# EAGLE design Smart ezNODE 503 M3 (EAGLE 7.7.0)
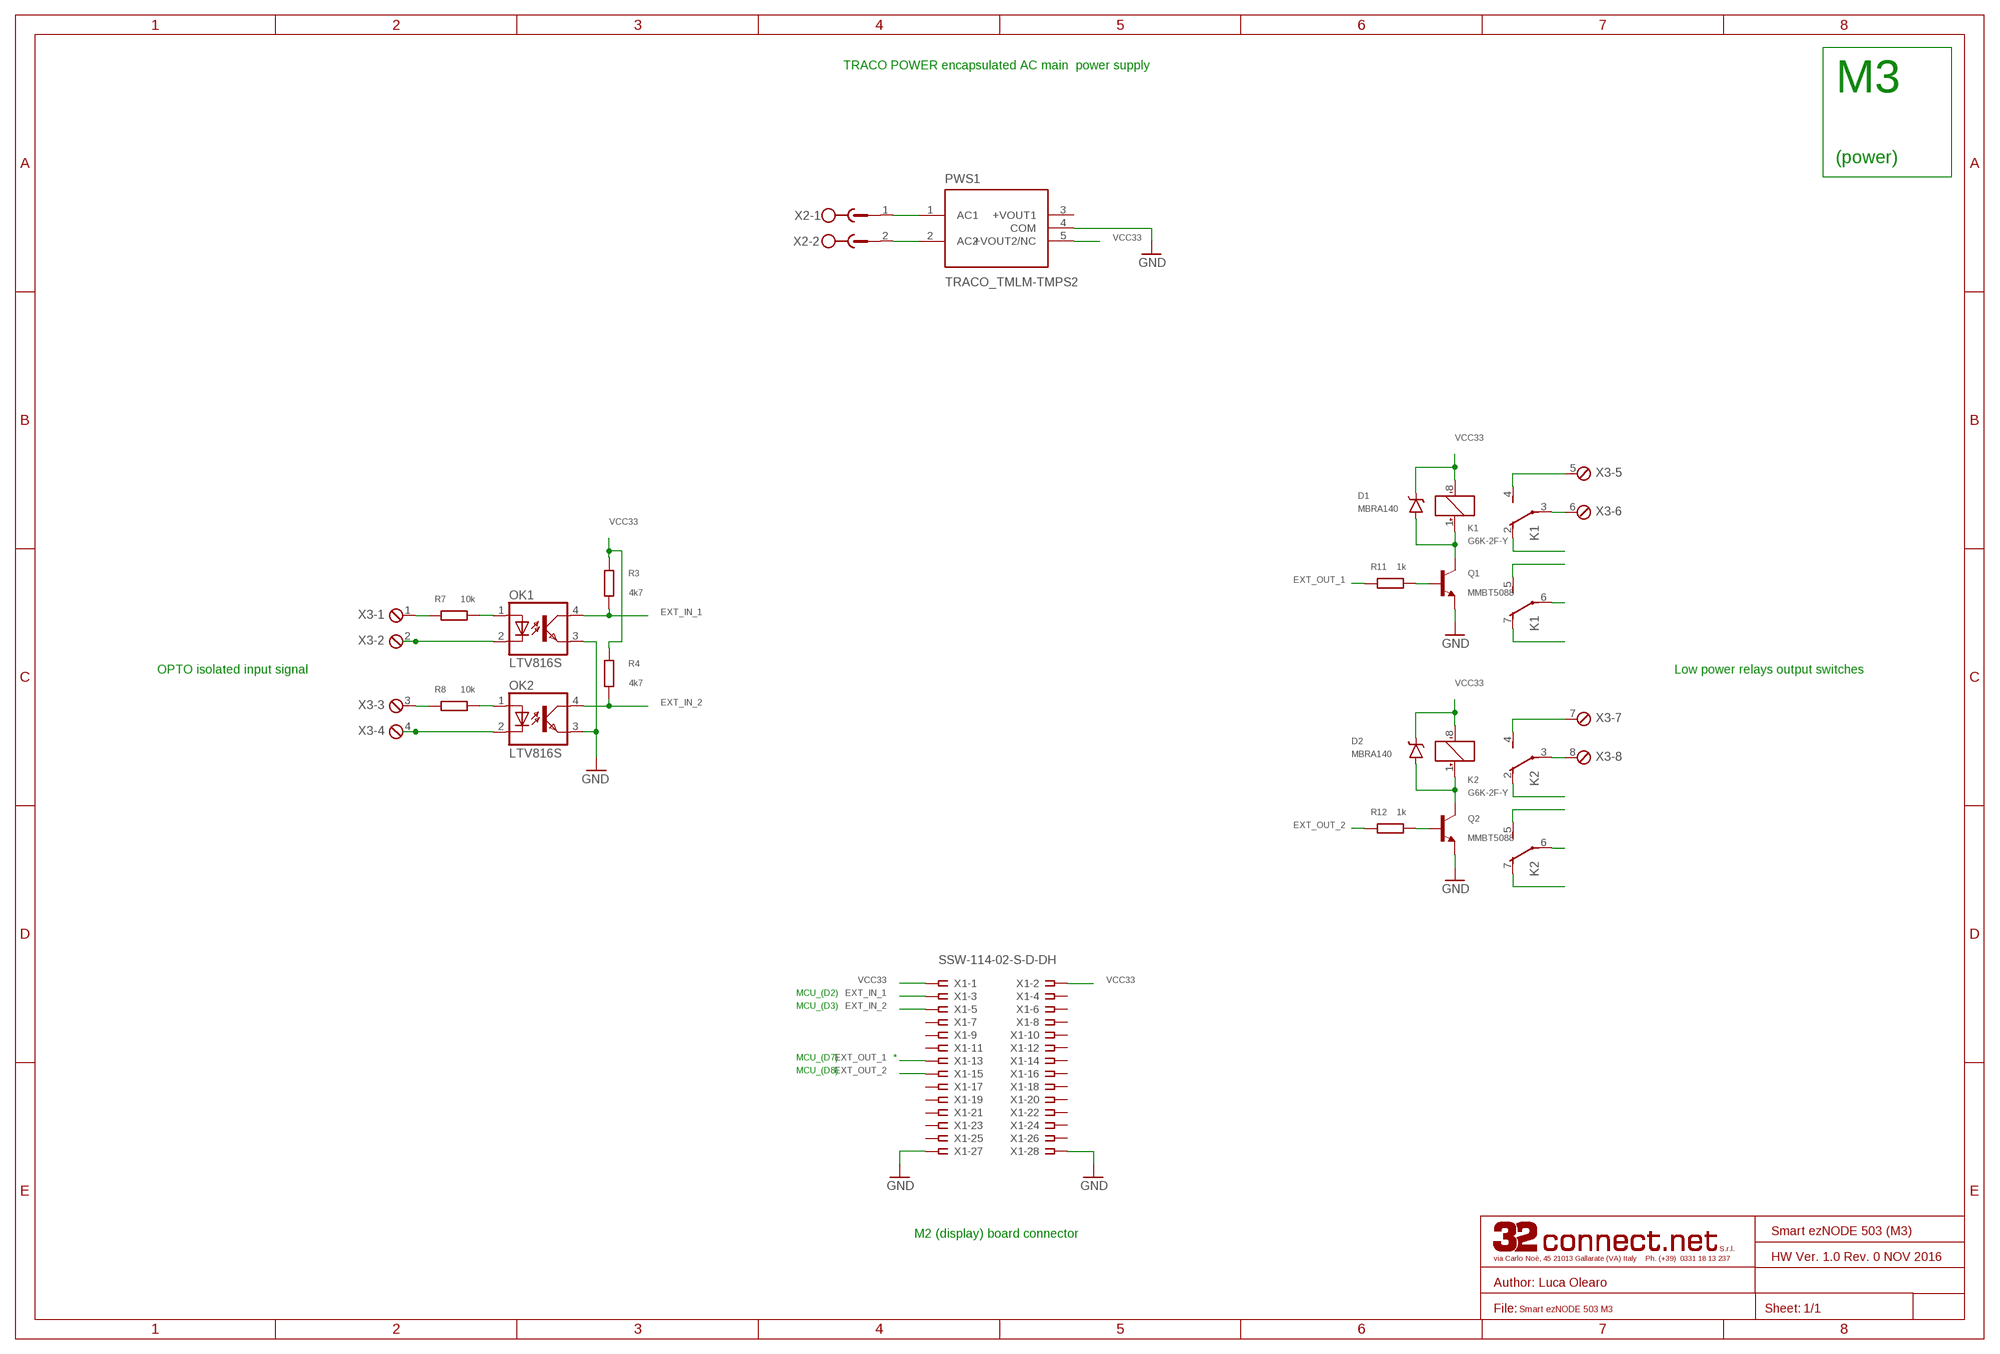
[diagram p0: schematic, sheet 1]

## Parts
D1  MBRA140  [SMA-DIODE]
D2  MBRA140  [SMA-DIODE]
K1  G6K-2F-Y  [G6K-2F-Y]
K2  G6K-2F-Y  [G6K-2F-Y]
OK1  LTV816S  [SMD4]
OK2  LTV816S  [SMD4]
PWS1  TRACO_TMLM-TMPS2  [TRACO_TMPS03XXX]
Q1  MMBT5088  TRANSISTOR_NPNMMBT5088  [SOT23-3]
Q2  MMBT5088  TRANSISTOR_NPNMMBT5088  [SOT23-3]
R3  4k7  R-EU_R0402  [R0402]
R4  4k7  R-EU_R0402  [R0402]
R7  10k  R-EU_R0402  [R0402]
R8  10k  R-EU_R0402  [R0402]
R11  1k  R-EU_R0402  [R0402]
R12  1k  R-EU_R0402  [R0402]
X1  SSW-114-02-S-D-DH  [FTE-114-XX-G-DH]
X2  MSTBV2  [MSTBV2]
X3  MPT8  [8POL254]

## Nets
EXT_IN_1: OK1.4(COL) R3.1 X1.3
EXT_IN_2: OK2.4(COL) R4.1 X1.5
EXT_OUT_1: R11.1 X1.13
EXT_OUT_2: R12.1 X1.15
GND [VCC1]: OK1.3(EMIT) OK2.3(EMIT) PWS1.4(COM) Q1.2(E) Q2.2(E) X1.27 X1.28
N$1: PWS1.1(AC1) X2.1
N$2: PWS1.2(AC2) X2.2
N$3: R7.1 X3.1
N$4: R8.1 X3.3
N$8 [SWITCH]: K1.4(2:S) X3.5
N$12: OK1.2(C) X3.2
N$14: OK1.1(A) R7.2
N$15: OK2.1(A) R8.2
N$16: OK2.2(C) X3.4
N$18 [SWITCH]: K1.3(2:P) X3.6
N$19: D1.A K1.1(1:+) Q1.3(C)
N$20 [SWITCH]: K1.2(2:O)
N$21: D2.A K2.1(1:+) Q2.3(C)
N$22: K1.5(3:S)
N$23: Q1.1(B) R11.2
N$24: Q2.1(B) R12.2
N$25: K1.6(3:P)
N$26: K1.7(3:O)
N$27 [SWITCH]: K2.4(2:S) X3.7
N$28 [SWITCH]: K2.3(2:P) X3.8
N$29 [SWITCH]: K2.2(2:O)
N$30: K2.5(3:S)
N$31: K2.6(3:P)
N$32: K2.7(3:O)
VCC33 [VCC1]: D1.C D2.C K1.8(1:-) K2.8(1:-) PWS1.5(+VOUT2/NC) R3.2 R4.2 X1.1 X1.2
Unconnected: PWS1.3(+VOUT1) X1.4 X1.6 X1.7 X1.8 X1.9 X1.10 X1.11 X1.12 X1.14 X1.16 X1.17 X1.18 X1.19 X1.20 X1.21 X1.22 X1.23 X1.24 X1.25 X1.26

## Notes on the sheet
- TRACO POWER encapsulated AC main  power supply
- M3
- (power)
- OPTO isolated input signal | Low power relays output switches
- MCU_(D2)
- MCU_(D3)
- MCU_(D7) | *
- MCU_(D8)
- M2 (display) board connector
- Smart ezNODE 503 (M3)
- HW Ver. 1.0 Rev. 0 NOV 2016

## Library data of the parts
D1 D2 = SparkFun-DiscreteSemi:MBRA140: 40V, 1A Schottky rectifier SMA/DO-214AC package DIO-08053; PROD_ID: DIO-08053
K1 K2 = relay:G6K: Low Signal Relay oeiwcsnts1.omron.com/.. D20G6K0100.pdf; MF: OMRON COMPONENTS USA; MPN: G6K-2F-Y DC3; OC_FARNELL: 1690316; OC_NEWARK: 89C6451
OK1 OK2 = optocoupler:LTV816: OPTO COUPLER Source: LITEON, LTV816.pdf; OC_FARNELL: unknown; OC_NEWARK: unknown
PWS1 = Multiconnect_base:TRACO_TMLM-TMPS
Q1 Q2 = SparkFun-DiscreteSemi:TRANSISTOR_NPN: Generic NPN BJT MMBT2222A - TRANS-08049 (SOT-23, 1A 40V) MPSA42 - TRANS-09116 (SOT-23, 500mA 300V) MMBT5088LT1G - TRANS-11160 (SOT-23, 50 mA 30V) BC547 - COM-08928 <http://www.sparkfun.com/products/8928> (TO-92 45V 100mA) (1.Collector 2.Base 3.Emitter) 2N3904 - COM-00521 <http://www.sparkfun.com/products/521> (TO-92 40V 200mA) (1.Emitter 2.Base 3.Collector) P2N2222A - COM-12852 <http://www.sparkfun.com/products/12852> (TO-92 40V 600mA) (1.Collector 2.Base 3.Emitter); PROD_ID: TRANS-11160
R3 R4 R7 R8 R11 R12 = rcl:R-EU_: RESISTOR, European symbol
X1 = Multiconnect_base:SSW-114-02-S-D: THROUGH-HOLE .025" SQ POST SOCKET Source: Samtec SSW.pdf
X2 = con-phoenix-500:MSTBV2: PHOENIX; OC_FARNELL: unknown; OC_NEWARK: unknown
X3 = Multiconnect_base:MPT8: PHOENIX CONNECTOR; OC_FARNELL: unknown; OC_NEWARK: unknown

## Net classes
0 default: width 0.203 mm, clearance 0.152 mm
1 VCC1: width 0.508 mm, clearance 0.305 mm
2 AC: width 1.016 mm, clearance 2.54 mm
3 SWITCH: width 0.61 mm, clearance 0.406 mm

## Board
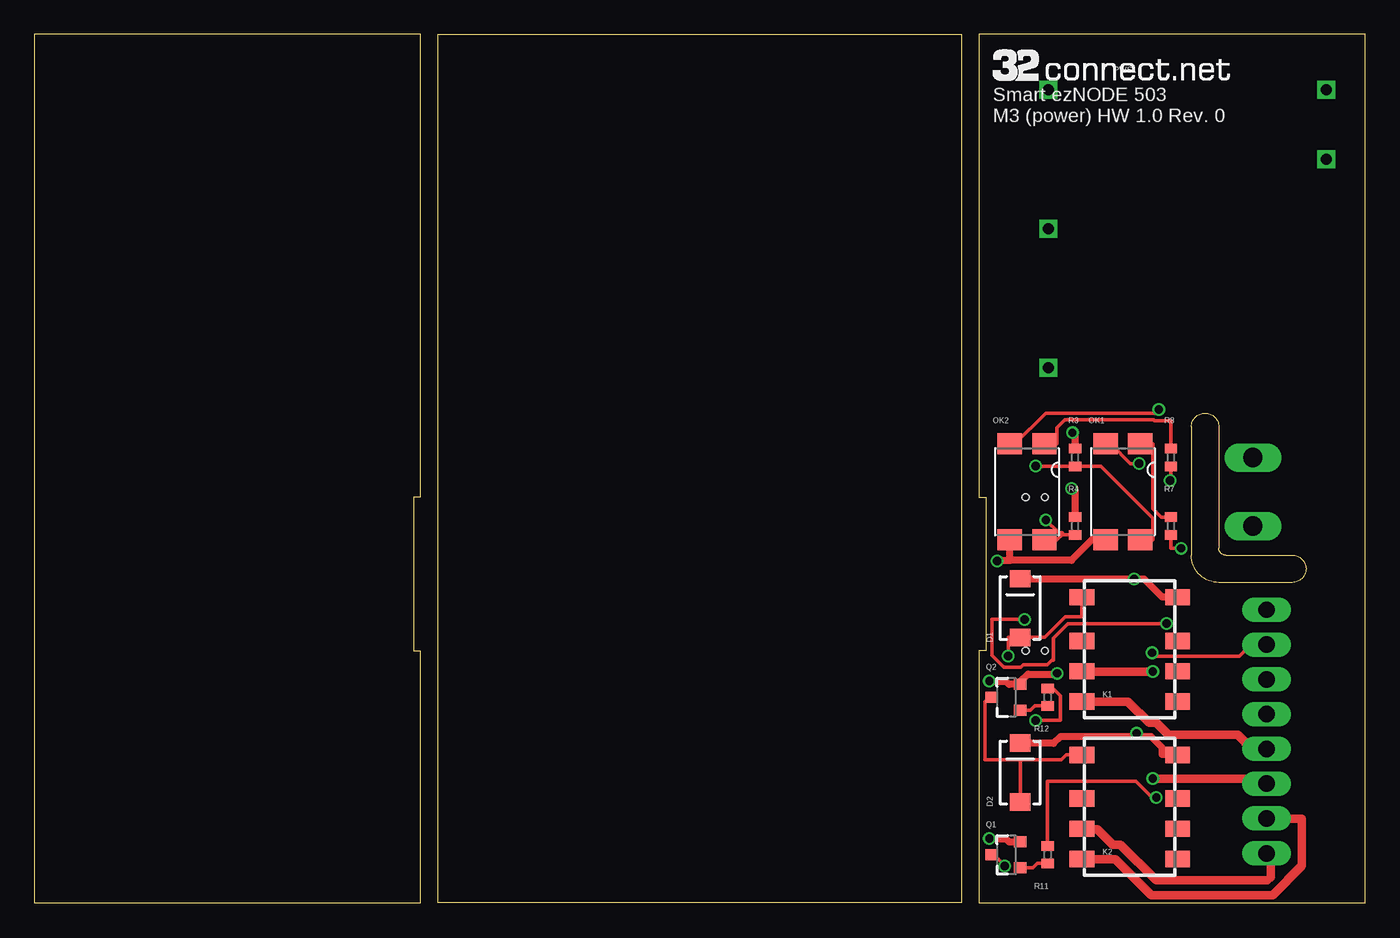
[diagram p1: board, top side]
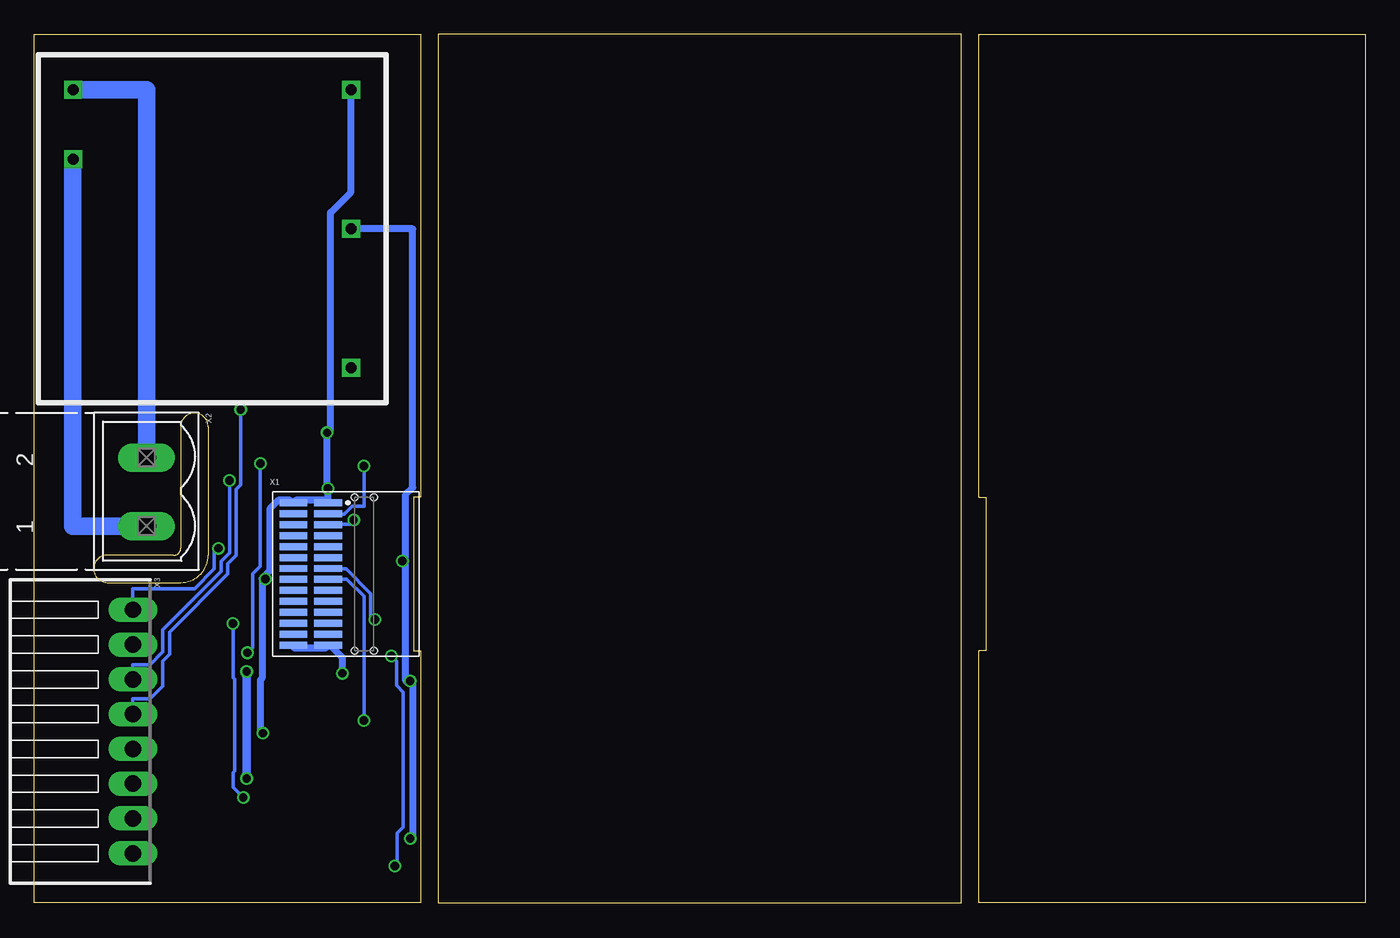
[diagram p2: board, bottom side, seen from below]

Size 97.2 x 63.4 mm. Coordinates in mm from the lower left corner, seen from the top.
Outline: 28.2,0 28.2,18.4 27.7,18.4 27.7,29.6 28.2,29.6 28.2,63.4 0,63.4 0,0 28.2,0
Outline: 67.7,0 29.5,0 29.5,63.4 67.7,63.4 67.7,0
Outline: 97.2,0 97.2,63.4 69,63.4 69,29.6 69.5,29.6 69.5,18.4 69,18.4 69,0 97.2,0
Outline: 84.5,34.75 arc-180 86.5,34.75 86.5,25.88 arc90 87,25.38 91.88,25.38 arc-180 91.88,23.38 86.5,23.38 arc-90 84.5,25.38 84.5,34.75
Copper layers (1*16): Top 0.035mm / dielectric 1.5mm / Bottom 0.035mm
Design rules "default *": minimum track width 10mil, minimum drill 24mil, track to track 8mil, track to pad 8mil, pad to pad 8mil, via to via 8mil, smd to smd 8mil, copper to edge 10mil, drill to drill 8mil, minimum pad ring 10mil, minimum via ring 6mil, stop-mask expansion 4mil, vias tented up to drill 0mil, thermal gap 10mil
Holes 0.5 mm at 72.4,29.6 73.8,29.6 72.4,18.4 73.8,18.4
tKeepout: area 0,62.2 to 13.2,63.4; area 0,0 to 13.2,1.2; area 29.5,0 to 67.7,1.2; area 29.5,62.2 to 67.7,63.4; area 84,62.2 to 97.2,63.4; area 84,0 to 97.2,1.2
bKeepout: area 0,62.2 to 13.2,63.4; area 0,0 to 13.2,1.2; area 29.5,0 to 67.7,1.2; area 29.5,62.2 to 67.7,63.4; area 84,62.2 to 97.2,63.4; area 84,0 to 97.2,1.2

### Footprints (pad centres in the part's own frame; a part is rotated, then mirrored left to right if it is on the bottom)
SMA-DIODE = smd 1.27 x 1.47: A -2.15,0; C 2.15,0
G6K-2F-Y = smd 1.2 x 1.8: 1 -3.8,-3.5; 2 -0.6,-3.5; 3 1.6,-3.5; 4 3.8,-3.5; 5 3.8,3.5; 6 1.6,3.5; 7 -0.6,3.5; 8 -3.8,3.5
SMD4 = smd 1.78 x 1.55: 1 -1.27,-3.5; 2 1.27,-3.5; 3 1.27,3.5; 4 -1.27,3.5
TRACO_TMPS03XXX = drill 0.8 square: 1 17.78,22.86; 2 22.86,22.86; 3 2.54,2.56; 4 12.7,2.56; 5 22.86,2.56
SOT23-3 = smd 0.8 x 0.9: 1 -0.95,-1; 2 0.95,-1; 3 0,1.1
R0402 = smd 0.7 x 0.9: 1 -0.65,0; 2 0.65,0
FTE-114-XX-G-DH = smd 0.508 x 2.032: 1 -5.2,1.27; 2 -5.2,-1.27; 3 -4.4,1.27; 4 -4.4,-1.27; 5 -3.6,1.27; 6 -3.6,-1.27; 7 -2.8,1.27; 8 -2.8,-1.27; 9 -2,1.27; 10 -2,-1.27; 11 -1.2,1.27; 12 -1.2,-1.27; 13 -0.4,1.27; 14 -0.4,-1.27; 15 0.4,1.27; 16 0.4,-1.27; 17 1.2,1.27; 18 1.2,-1.27; 19 2,1.27; 20 2,-1.27; 21 2.8,1.27; 22 2.8,-1.27; 23 3.6,1.27; 24 3.6,-1.27; 25 4.4,1.27; 26 4.4,-1.27; 27 5.2,1.27; 28 5.2,-1.27
MSTBV2 = drill 1.397 long: 1 -2.5,0; 2 2.5,0
8POL254 = drill 1.2 long: 1 -8.89,0; 2 -6.35,0; 3 -3.81,0; 4 -1.27,0; 5 1.27,0; 6 3.81,0; 7 6.35,0; 8 8.89,0

### Placement (x,y rotation side)
D1  72,21.5 90 top
D2  72,9.5 90 top
K1  80,18.5 270 top
K2  80,7 270 top
OK1  79.5,30 180 top
OK2  72.5,30 180 top
PWS1  71.5,36.5 90 bottom
Q1  71,3.5 90 top
Q2  71,15 90 top
R3  76,32.5 90 top
R4  76,27.5 90 top
R7  83,27.5 90 top
R8  83,32.5 90 top
R11  74,3.5 270 top
R12  74,15 270 top
X1  77,24 270 bottom
X2  89,30 90 bottom
X3  90,12.5 270 bottom

### Tracks (layer width: path | path; a pad name or v marks a point on that pad's centre or on a via)
EXT_IN_1  (via drill 0.61)
  Top 0.254: OK1.4 81.69,26.5 81.69,28.06 77.88,31.88 76,31.88 R3.1 75.88,31.88 v73.12,31.88
  Bottom 0.254: v73.12,31.88 73.12,28.94 74,28.94 74.56,28.38 75.69,28.38 X1.3
EXT_IN_2  (via drill 0.61)
  Top 0.254: 75.06,26.88 76,26.88 R4.1 | 75.06,26.88 74.69,26.5 OK2.4 | v73.88,27.94 74.81,27 75.06,27 75.06,26.88
  Bottom 0.254: v73.88,27.94 73.88,27.62 75.69,27.62 X1.5
EXT_OUT_1  (via drill 0.61)
  Top 0.254: R11.1 74,8.88 80.44,8.88 81.62,7.69 v81.94,7.69 | v82.69,20.38 75.5,20.38 74.44,19.31 74.44,17.69 74.31,17.69 74,17.38 72.25,17.38 72.06,17.19 70.81,17.19 69.94,18.06 69.94,20.69 v72.31,20.69
  Bottom 0.254: v81.94,7.69 82.69,8.44 82.69,9.5 82.56,9.62 82.56,16.31 82.69,16.44 v82.69,20.38 | v72.31,20.69 72.62,20.69 72.62,22.56 74.44,24.38 75.69,24.38 X1.13
EXT_OUT_2  (via drill 0.61)
  Top 0.254: v73.12,13.31 74.94,13.31 74.94,15.12 74.44,15.62 74,15.62 R12.1
  Bottom 0.254: v73.12,13.31 73.12,22.38 74.38,23.62 75.69,23.62 X1.15
GND  (via drill 0.61)
  Top 0.508: 71.25,25 71.25,26.5 OK2.3 | 71.25,25 75.75,25 77.25,26.5 OK1.3 | v69.75,4.69 70.94,4.69 71.19,4.44 72,4.44 Q1.2 | v69.75,16.19 69.81,16.12 71,16.12 71.19,15.94 72,15.94 Q2.2 72.06,16.19 72.56,16.69 74.62,16.69 v74.69,16.75 | 71.25,25 70.38,25 v70.31,24.94
  Bottom 0.508: X1.28 78.25,18.75 78.25,18.62 75.88,18.62 75.75,18.75 X1.27 75.5,18.69 74.69,17.88 v74.69,16.75 | v69.75,4.69 69.56,4.69 69.56,16 v69.75,16.19 70,16.12 70.06,16.19 70.06,24.94 | 70.06,24.94 70.06,29.81 69.56,30.31 69.56,49.19 74,49.19 PWS1.4 | v70.31,24.94 70.06,24.94
N$1
  Bottom 1.27: PWS1.1 94.4,54.28 94.4,27.5 X2.1
N$2
  Bottom 1.27: PWS1.2 89,59.36 X2.2
N$3  (via drill 0.61)
  Top 0.254: R7.1 83,25.88 v83.75,25.88
  Bottom 0.254: v83.75,25.88 84.06,25.88 84.06,24.38 85.5,22.94 90,22.94 X3.1
N$4  (via drill 0.61)
  Top 0.254: R8.1 83,30.81 v82.94,30.81
  Bottom 0.254: v82.94,30.81 82.94,25.56 83.56,24.94 83.56,24.19 87.81,19.94 87.81,18.31 88.75,17.38 90,17.38 X3.3
N$6
  cutout Top (no thermals): 85.5,24.38 85.5,62.5 97,62.5 97,24.38
N$7
  cutout Bottom (no thermals): 85.5,24.38 85.5,62.5 97,62.5 97,24.38
N$8
  Top 0.61: K1.4 76.5,14.69 79.88,14.69 81.44,13.12 81.94,13.12 82.81,12.25 87.88,12.25 88.88,11.25 90,11.25 X3.5
N$12  (via drill 0.61)
  Top 0.254: OK1.2 78.62,33.5 80.06,32.06 v80.69,32.06 | v81.62,18.25 81.88,18 88,18 88.88,18.88 90,18.88 X3.2
  Bottom 0.254: v80.69,32.06 80.69,24.56 81.25,24 81.25,18.62 v81.62,18.25
N$14
  Top 0.254: OK1.1 81.69,33.5 81.69,28.75 82.31,28.12 83,28.12 R7.2
N$15
  Top 0.254: R8.2 83,35.19 81.81,35.19 81.75,35.25 75.25,35.25 74.69,34.69 74.69,33.5 OK2.1
N$16  (via drill 0.61)
  Top 0.254: OK2.2 71.62,33.5 73.88,35.75 81.88,35.75 v82.12,36
  Bottom 0.254: v82.12,36 82.12,30.5 82.44,30.19 82.44,25.38 83.06,24.75 83.06,24 87.31,19.75 87.31,18.12 87.81,17.62 87.81,15.81 88.75,14.88 90,14.88 X3.4
N$18  (via drill 0.61)
  Top 0.61: v81.69,16.88 76.5,16.88 K1.3 | v81.69,9.06 88.5,9.06 88.88,8.69 X3.6
  Bottom 0.61: v81.69,9.06 v81.69,16.88
N$19  (via drill 0.61)
  Top 0.254: Q1.3 70.06,3.5 v70.88,2.69 | v71.12,18 71.12,19.38 72,19.38 D1.A 72.12,19.38 73.81,19.38 75.31,20.88 76.5,20.88 K1.1
  Bottom 0.254: v70.88,2.69 70.69,2.88 70.69,5.06 70.25,5.5 70.25,15.38 70.75,15.88 70.75,17.62 v71.12,18
N$21
  Top 0.254: Q2.3 69.75,15 69.44,14.69 69.44,10.44 72,10.44 | 72,10.44 75,10.44 75.38,10.81 76.5,10.81 K2.1 | 72,10.44 D2.A
N$23
  Top 0.254: Q1.1 72,2.56 72.94,2.56 73.25,2.88 74,2.88 R11.2
N$24
  Top 0.254: Q2.1 72,14.06 72.75,14.06 73.06,14.38 74,14.38 R12.2
N$27
  Top 0.61: K2.4 76.5,3.19 78.94,3.19 81.56,0.56 90.44,0.56 92.56,2.69 92.56,6.12 90,6.12 X3.7
N$28
  Top 0.61: K2.3 76.5,5.38 77.62,5.38 78.75,4.25 79.31,4.25 81.94,1.62 90.06,1.62 90.31,1.88 90.31,3.62 90,3.62 X3.8
VCC33  (via drill 0.61)
  Top 0.508: D1.C 72,23.62 v80.31,23.62 81.06,23.62 82.38,22.31 83.5,22.31 K1.8 | 80.5,12.12 81.56,12.12 82.38,11.31 82.38,10.81 83.5,10.81 K2.8 | 80.5,12.12 74.94,12.12 74.44,11.62 72,11.62 D2.C | R4.2 76,30.25 v75.75,30.25 | R3.2 76,34.31 v75.81,34.31 | v80.5,12.38 80.5,12.12
  Bottom 0.508: PWS1.5 74.06,59.31 74.06,51.88 75.56,50.38 75.56,34.38 v75.81,34.31 75.81,30.5 v75.75,30.25 75.75,29.25 X1.1 76,29.38 78.12,29.38 78.25,29.25 X1.2 78.5,29.31 78.5,29.38 79.38,29.38 80,28.75 80,24.25 80.56,23.69 80.56,23.62 | v80.5,12.38 80.69,12.38 80.69,16.25 80.56,16.38 80.56,23.62 | v80.31,23.62 80.56,23.62

### Text on the board
tNames: Smart ezNODE 503 / M3 (power) HW 1.0 Rev. 0